# EAGLE schematic MCP23017 (EAGLE 7.3.0)
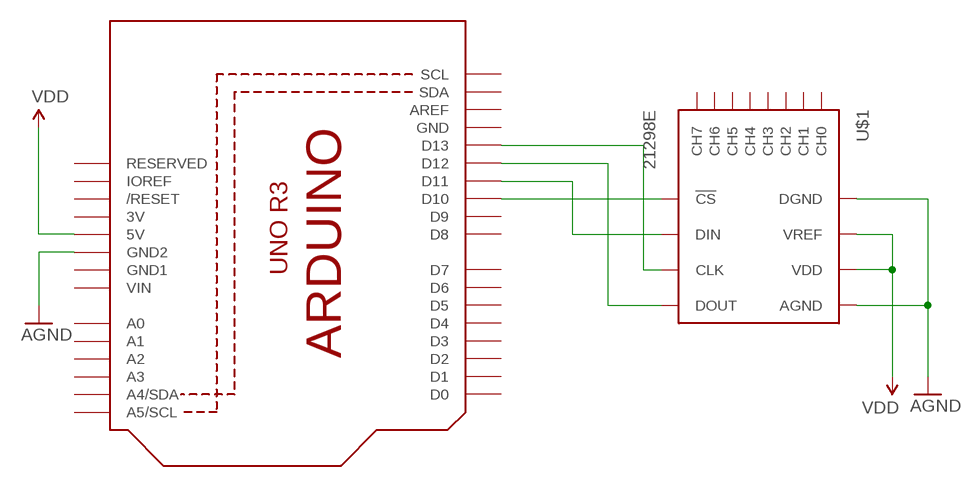
[diagram p0: schematic, sheet 1]

## Parts
U1  ARDUINOR3-BPLACE  [ARDUINOR3-BPLACE]
U$1  21298E  [PDIP16]

## Nets
AGND: U1.GND2 U$1.P$9(DGND) U$1.P$14(AGND)
N$1: U1.D10 U$1.P$10(!CS)
N$2: U1.D11 U$1.P$11(DIN)
N$3: U1.D12 U$1.P$12(DOUT)
N$4: U1.D13 U$1.P$13(CLK)
VDD: U1.5V U$1.P$15(VREF) U$1.P$16(VDD)
Unconnected: U1.A0 U1.A1 U1.A2 U1.A3 U1.A4(A4/SDA) U1.A5(A5/SCL) U1.AREF U1.D0 U1.D1 U1.D2 U1.D3 U1.D4 U1.D5 U1.D6 U1.D7 U1.D8 U1.D9 U1.IOREF U1.RESERVED U1.RESET(/RESET) U1.SCL U1.SDA U$1.P$1(CH0) U$1.P$2(CH1) U$1.P$3(CH2) U$1.P$4(CH3) U$1.P$5(CH4) U$1.P$6(CH5) U$1.P$7(CH6) U$1.P$8(CH7)

## Power pins joined to a net without a drawn wire
3V: U1.3V
GND: U1.GND
GND1: U1.GND1
VIN: U1.VIN

## Library data of the parts
U1 = adafruit:ARDUINOR3: This is a new object for the new Arduino R3 - with extra pins that you may want to use (such as IOref, and duplicated A4/A5
U$1 = MCP3208:21298E